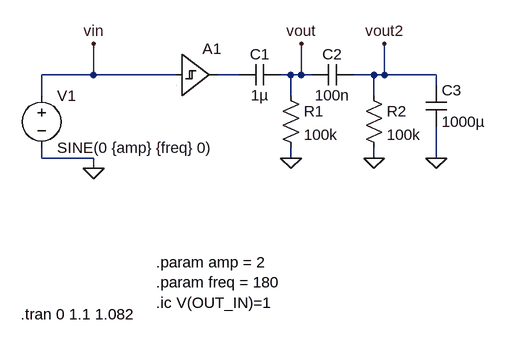
[diagram p0: schematic ferroelectric_cap.asc]
ferroelectric_cap.asc, the LTspice schematic file:
Version 4
SHEET 1 880 680
WIRE 80 144 80 96
WIRE 80 144 0 144
WIRE 208 144 80 144
WIRE 304 144 272 144
WIRE 384 144 368 144
WIRE 400 144 400 96
WIRE 400 144 384 144
WIRE 416 144 400 144
WIRE 512 144 480 144
WIRE 528 144 528 96
WIRE 528 144 512 144
WIRE 608 144 528 144
WIRE 608 160 608 144
WIRE 0 176 0 144
WIRE 384 176 384 144
WIRE 512 176 512 144
WIRE 0 272 0 256
WIRE 80 272 0 272
WIRE 384 272 384 256
WIRE 512 272 512 256
WIRE 608 272 608 224
WIRE 80 288 80 272
FLAG 80 96 vin
FLAG 80 288 0
FLAG 384 272 0
FLAG 400 96 vout
FLAG 512 272 0
FLAG 608 272 0
FLAG 528 96 vout2
SYMBOL voltage 0 160 R0
WINDOW 123 0 0 Left 0
WINDOW 39 0 0 Left 0
SYMATTR InstName V1
SYMATTR Value SINE(0 {amp} {freq} 0)
SYMBOL Digital\\schmtbuf 208 80 R0
SYMATTR InstName A1
SYMBOL cap 368 128 R90
WINDOW 0 0 32 VBottom 2
WINDOW 3 32 32 VTop 2
SYMATTR InstName C1
SYMATTR Value 1µ
SYMBOL cap 480 128 R90
WINDOW 0 0 32 VBottom 2
WINDOW 3 32 32 VTop 2
SYMATTR InstName C2
SYMATTR Value 100n
SYMBOL res 368 160 R0
SYMATTR InstName R1
SYMATTR Value 100k
SYMBOL res 496 160 R0
SYMATTR InstName R2
SYMATTR Value 100k
SYMBOL cap 592 160 R0
SYMATTR InstName C3
SYMATTR Value 1000µ
TEXT 176 432 Left 2 !.param amp = 2\n.param freq = 180\n.ic V(OUT_IN)=1
TEXT -32 512 Left 2 !.tran 0 1.1 1.082

The netlist it stands for:
* ferroelectric_cap.asc
V1 vin 0 SINE(0 {amp} {freq} 0)
A1 vin 0 0 0 0 0 N001 0 SCHMITT
C1 vout N001 1µ
C2 vout2 vout 100n
R1 vout 0 100k
R2 vout2 0 100k
C3 vout2 0 1000µ
.param amp = 2
.param freq = 180
.ic V(OUT_IN)=1
.tran 0 1.1 1.082
.backanno
.end